# Altium schematic sheet DashLogger.SchDoc
size A4; SheetNumber: 1; SheetTotal: 9
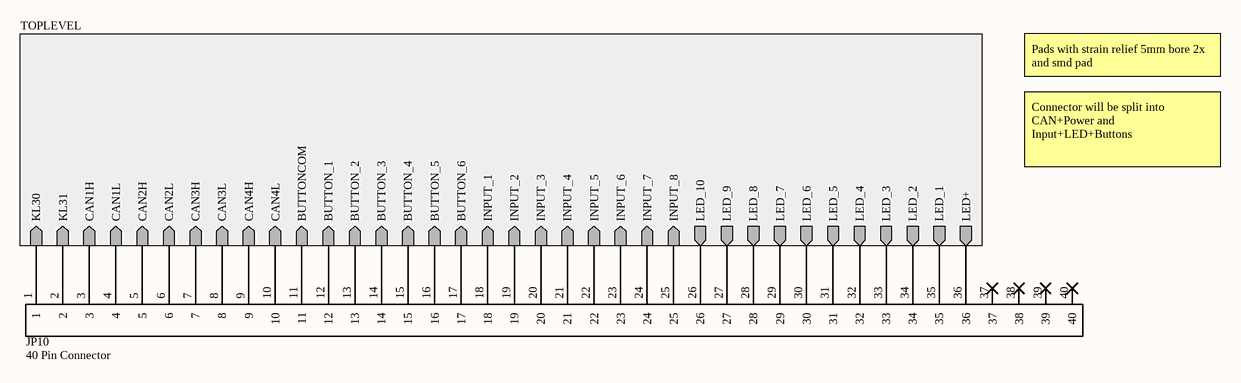
[diagram p0: DashLogger.SchDoc]

## Parts
JP10  40 Pin Connector

## Sub-sheets
TOPLEVEL = TopLevel.SchDoc: KL30 (in), KL31 (in), CAN1H (in), CAN1L (in), CAN2H (in), CAN2L (in), CAN3H (in), CAN3L (in), CAN4H (in), CAN4L (in), BUTTONCOM (in), BUTTON_1 (in), BUTTON_2 (in), BUTTON_3 (in), BUTTON_4 (in), BUTTON_5 (in), BUTTON_6 (in), INPUT_1 (in), INPUT_2 (in), INPUT_3 (in), INPUT_4 (in), INPUT_5 (in), INPUT_6 (in), INPUT_7 (in), INPUT_8 (in), LED_10 (out), LED_9 (out), LED_8 (out), LED_7 (out), LED_6 (out), LED_5 (out), LED_4 (out), LED_3 (out), LED_2 (out), LED_1 (out), LED+ (out)

## Nets
NetJP10_1: JP10.1 ; sheet TOPLEVEL/KL30
NetJP10_2: JP10.2 ; sheet TOPLEVEL/KL31
NetJP10_3: JP10.3 ; sheet TOPLEVEL/CAN1H
NetJP10_4: JP10.4 ; sheet TOPLEVEL/CAN1L
NetJP10_5: JP10.5 ; sheet TOPLEVEL/CAN2H
NetJP10_6: JP10.6 ; sheet TOPLEVEL/CAN2L
NetJP10_7: JP10.7 ; sheet TOPLEVEL/CAN3H
NetJP10_8: JP10.8 ; sheet TOPLEVEL/CAN3L
NetJP10_9: JP10.9 ; sheet TOPLEVEL/CAN4H
NetJP10_10: JP10.10 ; sheet TOPLEVEL/CAN4L
NetJP10_11: JP10.11 ; sheet TOPLEVEL/BUTTONCOM
NetJP10_12: JP10.12 ; sheet TOPLEVEL/BUTTON_1
NetJP10_13: JP10.13 ; sheet TOPLEVEL/BUTTON_2
NetJP10_14: JP10.14 ; sheet TOPLEVEL/BUTTON_3
NetJP10_15: JP10.15 ; sheet TOPLEVEL/BUTTON_4
NetJP10_16: JP10.16 ; sheet TOPLEVEL/BUTTON_5
NetJP10_17: JP10.17 ; sheet TOPLEVEL/BUTTON_6
NetJP10_18: JP10.18 ; sheet TOPLEVEL/INPUT_1
NetJP10_19: JP10.19 ; sheet TOPLEVEL/INPUT_2
NetJP10_20: JP10.20 ; sheet TOPLEVEL/INPUT_3
NetJP10_21: JP10.21 ; sheet TOPLEVEL/INPUT_4
NetJP10_22: JP10.22 ; sheet TOPLEVEL/INPUT_5
NetJP10_23: JP10.23 ; sheet TOPLEVEL/INPUT_6
NetJP10_24: JP10.24 ; sheet TOPLEVEL/INPUT_7
NetJP10_25: JP10.25 ; sheet TOPLEVEL/INPUT_8
NetJP10_26: JP10.26 ; sheet TOPLEVEL/LED_10
NetJP10_27: JP10.27 ; sheet TOPLEVEL/LED_9
NetJP10_28: JP10.28 ; sheet TOPLEVEL/LED_8
NetJP10_29: JP10.29 ; sheet TOPLEVEL/LED_7
NetJP10_30: JP10.30 ; sheet TOPLEVEL/LED_6
NetJP10_31: JP10.31 ; sheet TOPLEVEL/LED_5
NetJP10_32: JP10.32 ; sheet TOPLEVEL/LED_4
NetJP10_33: JP10.33 ; sheet TOPLEVEL/LED_3
NetJP10_34: JP10.34 ; sheet TOPLEVEL/LED_2
NetJP10_35: JP10.35 ; sheet TOPLEVEL/LED_1
NetJP10_36: JP10.36 ; sheet TOPLEVEL/LED+

Not connected (* = marked no-connect by the designer): JP10 37* 38* 39* 40*

## Notes on the sheet
- Pads with strain relief 5mm bore 2x and smd pad
- Connector will be split into CAN+Power and Input+LED+Buttons

## Library data of the parts
JP10 = MainConnector